# EAGLE design interface (EAGLE 5.10)
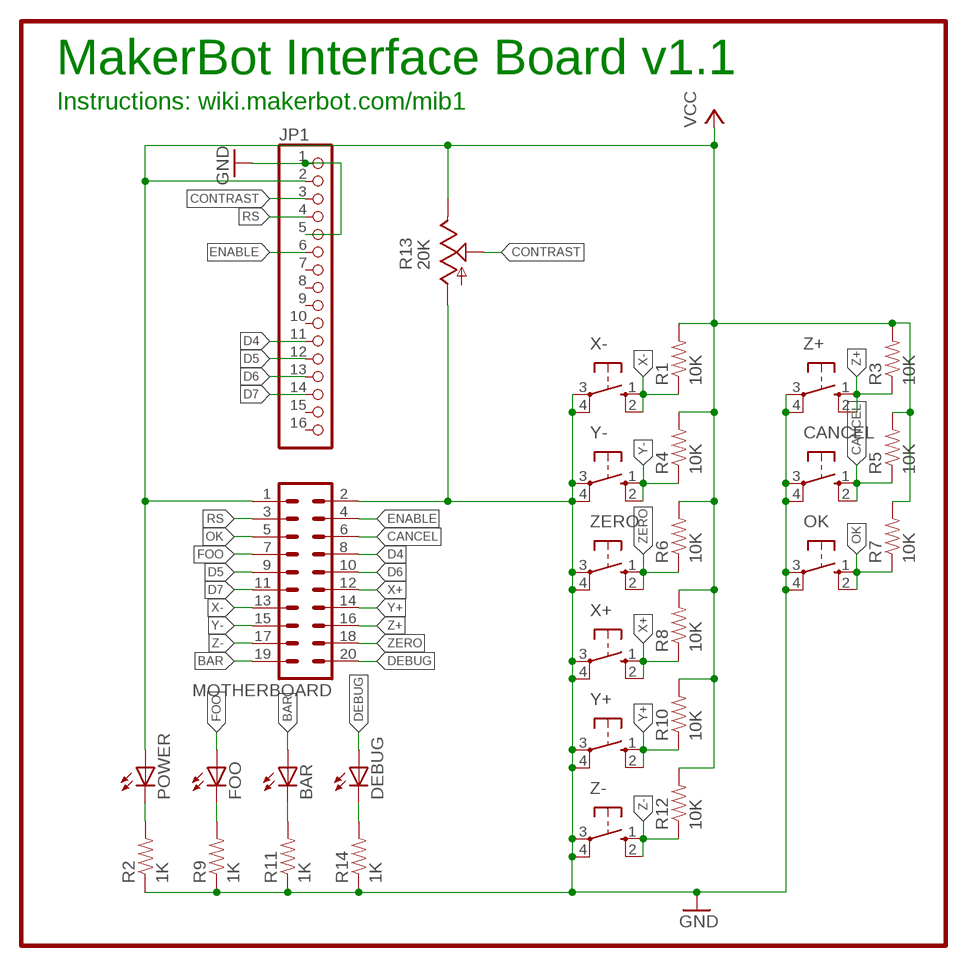
[diagram p0: schematic, sheet 1]

## Parts
BAR  LED5MM  [LED5MM]
CANCEL  40-XX  [B3F-40XX]
DEBUG  LED5MM  [LED5MM]
FOO  LED5MM  [LED5MM]
JP1  PINHD-1X16  [1X16]
MOTHERBOARD  ML20  [ML20]
OK  40-XX  [B3F-40XX]
POWER  LED5MM  [LED5MM]
R1  10K  RESISTORPTH1  [AXIAL-0.3]
R2  1K  RESISTORPTH1  [AXIAL-0.3]
R3  10K  RESISTORPTH1  [AXIAL-0.3]
R4  10K  RESISTORPTH1  [AXIAL-0.3]
R5  10K  RESISTORPTH1  [AXIAL-0.3]
R6  10K  RESISTORPTH1  [AXIAL-0.3]
R7  10K  RESISTORPTH1  [AXIAL-0.3]
R8  10K  RESISTORPTH1  [AXIAL-0.3]
R9  1K  RESISTORPTH1  [AXIAL-0.3]
R10  10K  RESISTORPTH1  [AXIAL-0.3]
R11  1K  RESISTORPTH1  [AXIAL-0.3]
R12  10K  RESISTORPTH1  [AXIAL-0.3]
R13  20K  TRIM_US-B25P  [B25P]
R14  1K  RESISTORPTH1  [AXIAL-0.3]
X+  40-XX  [B3F-40XX]
X-  40-XX  [B3F-40XX]
Y+  40-XX  [B3F-40XX]
Y-  40-XX  [B3F-40XX]
Z+  40-XX  [B3F-40XX]
Z-  40-XX  [B3F-40XX]
ZERO  40-XX  [B3F-40XX]

## Nets
BAR: BAR.A MOTHERBOARD.19
CANCEL: CANCEL.1(S) CANCEL.2(S1) MOTHERBOARD.6 R5.P$1
CONTRAST: JP1.3 R13.S
D4: JP1.11 MOTHERBOARD.8
D5: JP1.12 MOTHERBOARD.9
D6: JP1.13 MOTHERBOARD.10
D7: JP1.14 MOTHERBOARD.11
DEBUG: DEBUG.A MOTHERBOARD.20
ENABLE: JP1.6 MOTHERBOARD.4
FOO: FOO.A MOTHERBOARD.7
GND: CANCEL.3(P) CANCEL.4(P1) JP1.1 JP1.5 MOTHERBOARD.2 OK.3(P) OK.4(P1) R2.P$1 R9.P$1 R11.P$1 R13.A R14.P$1 X+.3(P) X+.4(P1) X-.3(P) X-.4(P1) Y+.3(P) Y+.4(P1) Y-.3(P) Y-.4(P1) Z+.3(P) Z+.4(P1) Z-.3(P) Z-.4(P1) ZERO.3(P) ZERO.4(P1)
N$1: POWER.K(C) R2.P$2
N$2: FOO.K(C) R9.P$2
N$3: BAR.K(C) R11.P$2
N$4: DEBUG.K(C) R14.P$2
OK: MOTHERBOARD.5 OK.1(S) OK.2(S1) R7.P$1
RS: JP1.4 MOTHERBOARD.3
VCC: JP1.2 MOTHERBOARD.1 POWER.A R1.P$2 R3.P$2 R4.P$2 R5.P$2 R6.P$2 R7.P$2 R8.P$2 R10.P$2 R12.P$2 R13.E
X+: MOTHERBOARD.12 R8.P$1 X+.1(S) X+.2(S1)
X-: MOTHERBOARD.13 R1.P$1 X-.1(S) X-.2(S1)
Y+: MOTHERBOARD.14 R10.P$1 Y+.1(S) Y+.2(S1)
Y-: MOTHERBOARD.15 R4.P$1 Y-.1(S) Y-.2(S1)
Z+: MOTHERBOARD.16 R3.P$1 Z+.1(S) Z+.2(S1)
Z-: MOTHERBOARD.17 R12.P$1 Z-.1(S) Z-.2(S1)
ZERO: MOTHERBOARD.18 R6.P$1 ZERO.1(S) ZERO.2(S1)
Unconnected: JP1.7 JP1.8 JP1.9 JP1.10 JP1.15 JP1.16

## Notes on the sheet
- MakerBot Interface Board v1.1
- Instructions: wiki.makerbot.com/mib1

## Library data of the parts
BAR DEBUG FOO POWER = led:LED: LED OSRAM: - CHIPLED LG R971, LG N971, LY N971, LG Q971, LY Q971, LO R971, LY R971 LH N974, LH R974 LS Q976, LO Q976, LY Q976 LO Q996 - Hyper CHIPLED LW Q18S LB Q993, LB Q99A, LB R99A - SideLED LS A670, LO A670, LY A670, LG A670, LP A670 LB A673, LV A673, LT A673, LW A673 LH A674 LY A675 LS A676, LA A676, LO A676, LY A676, LW A676 LS A679, LY A679, LG A679 - Hyper Micro SIDELED® LS Y876, LA Y876, LO Y876, LY Y876 LT Y87S - SmartLED LW L88C, LW L88S LB L89C, LB L89S, LG L890 LS L89K, LO L89K, LY L89K LS L896, LA L896, LO L896, LY L896 - TOPLED LS T670, LO T670, LY T670, LG T670, LP T670 LSG T670, LSP T670, LSY T670, LOP T670, LYG T670 LG T671, LOG T671, LSG T671 LB T673, LV T673, LT T673, LW T673 LH T674 LS T676, LA T676, LO T676, LY T676, LB T676, LH T676, LSB T676, LW T676 LB T67C, LV T67C, LT T67C, LS T67K, LO T67K, LY T67K, LW E67C LS E67B, LA E67B, LO E67B, LY E67B, LB E67C, LV E67C, LT E67C LW T67C LS T679, LY T679, LG T679 LS T770, LO T770, LY T770, LG T770, LP T770 LB T773, LV T773, LT T773, LW T773 LH T774 LS E675, LA E675, LY E675, LS T675 LS T776, LA T776, LO T776, LY T776, LB T776 LHGB T686 LT T68C, LB T68C - Hyper Mini TOPLED® LB M676 - Mini TOPLED Santana® LG M470 LS M47K, LO M47K, LY M47K Source: http://www.osram.convergy.de LUXEON: - LUMILED® LXK2-PW12-R00, LXK2-PW12-S00, LXK2-PW14-U00, LXK2-PW14-V00 LXK2-PM12-R00, LXK2-PM12-S00, LXK2-PM14-U00 LXK2-PE12-Q00, LXK2-PE12-R00, LXK2-PE12-S00, LXK2-PE14-T00, LXK2-PE14-U00 LXK2-PB12-K00, LXK2-PB12-L00, LXK2-PB12-M00, LXK2-PB14-N00, LXK2-PB14-P00, LXK2-PB14-Q00 LXK2-PR12-L00, LXK2-PR12-M00, LXK2-PR14-Q00, LXK2-PR14-R00 LXK2-PD12-Q00, LXK2-PD12-R00, LXK2-PD12-S00 LXK2-PH12-R00, LXK2-PH12-S00 LXK2-PL12-P00, LXK2-PL12-Q00, LXK2-PL12-R00 Source: www.luxeon.com KINGBRIGHT: KA-3528ASYC Source: www.kingbright.com
CANCEL OK X+ X- Y+ Y- Z+ Z- ZERO = switch-omron:40-XX: OMRON SWITCH
JP1 = pinhead:PINHD-1X16: PIN HEADER
MOTHERBOARD = con-ml:ML20: HARTING
R1-R12 R14 = SparkFun:RESISTOR: Resistor Basic schematic elements and footprints for 0603, 1206, and PTH 1/10th watt (small) resistors.
R13 = pot:TRIM_US-: POTENTIOMETER

## Net classes
0 default: width 0.305 mm, clearance 0.254 mm

## Board
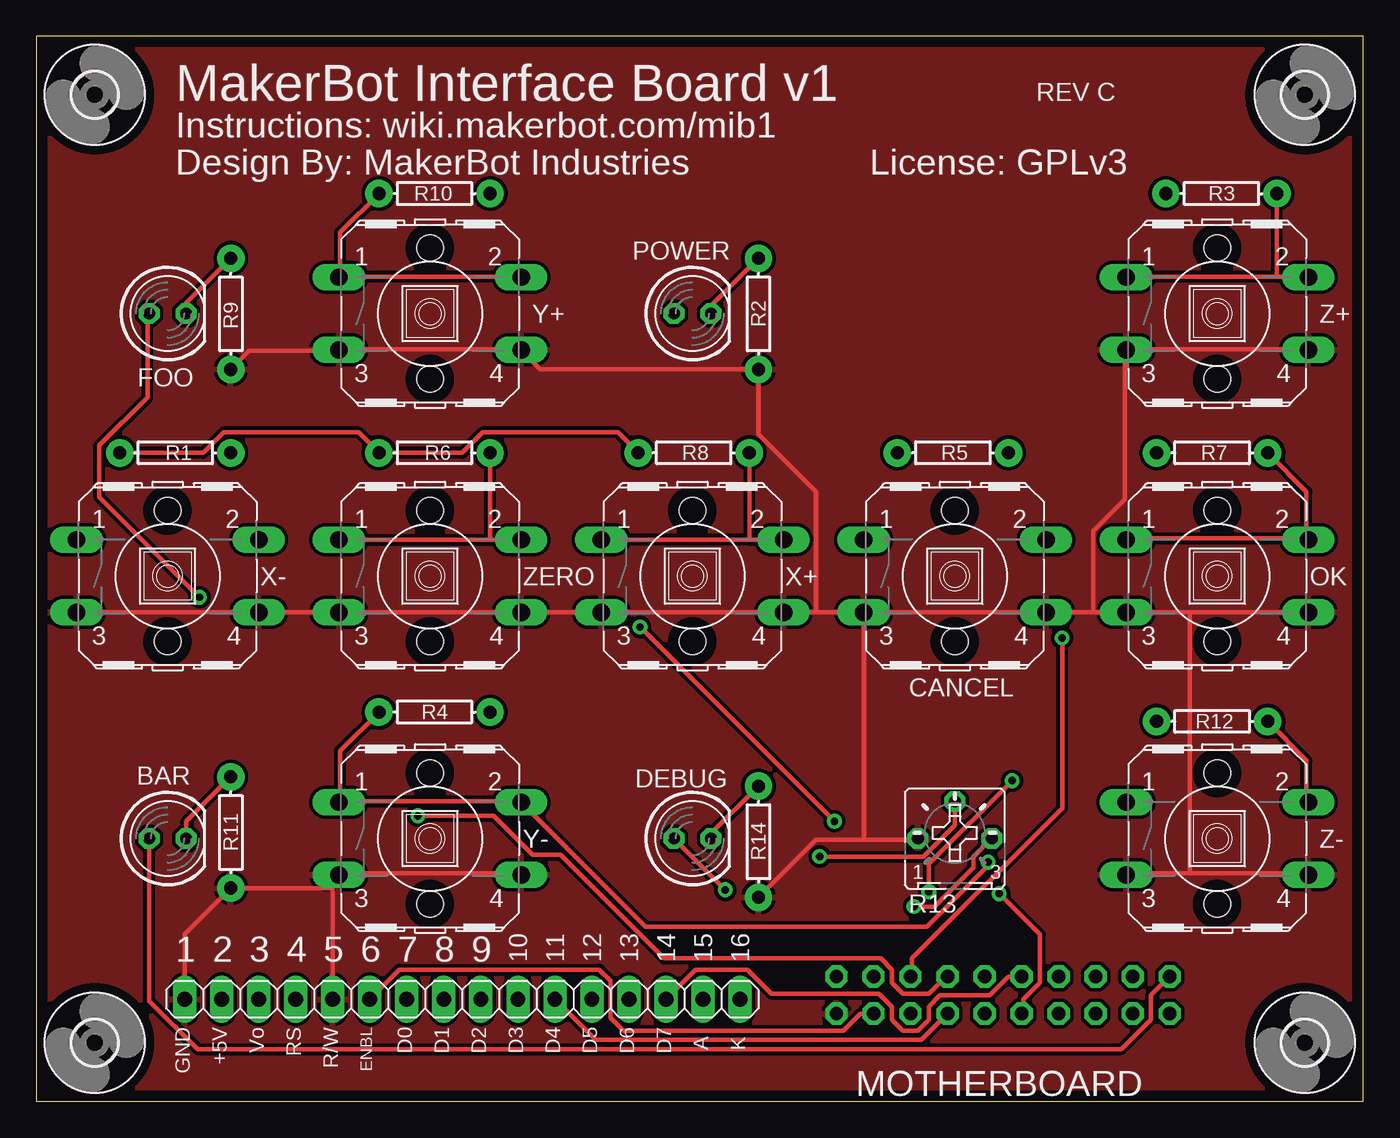
[diagram p1: board, top side]
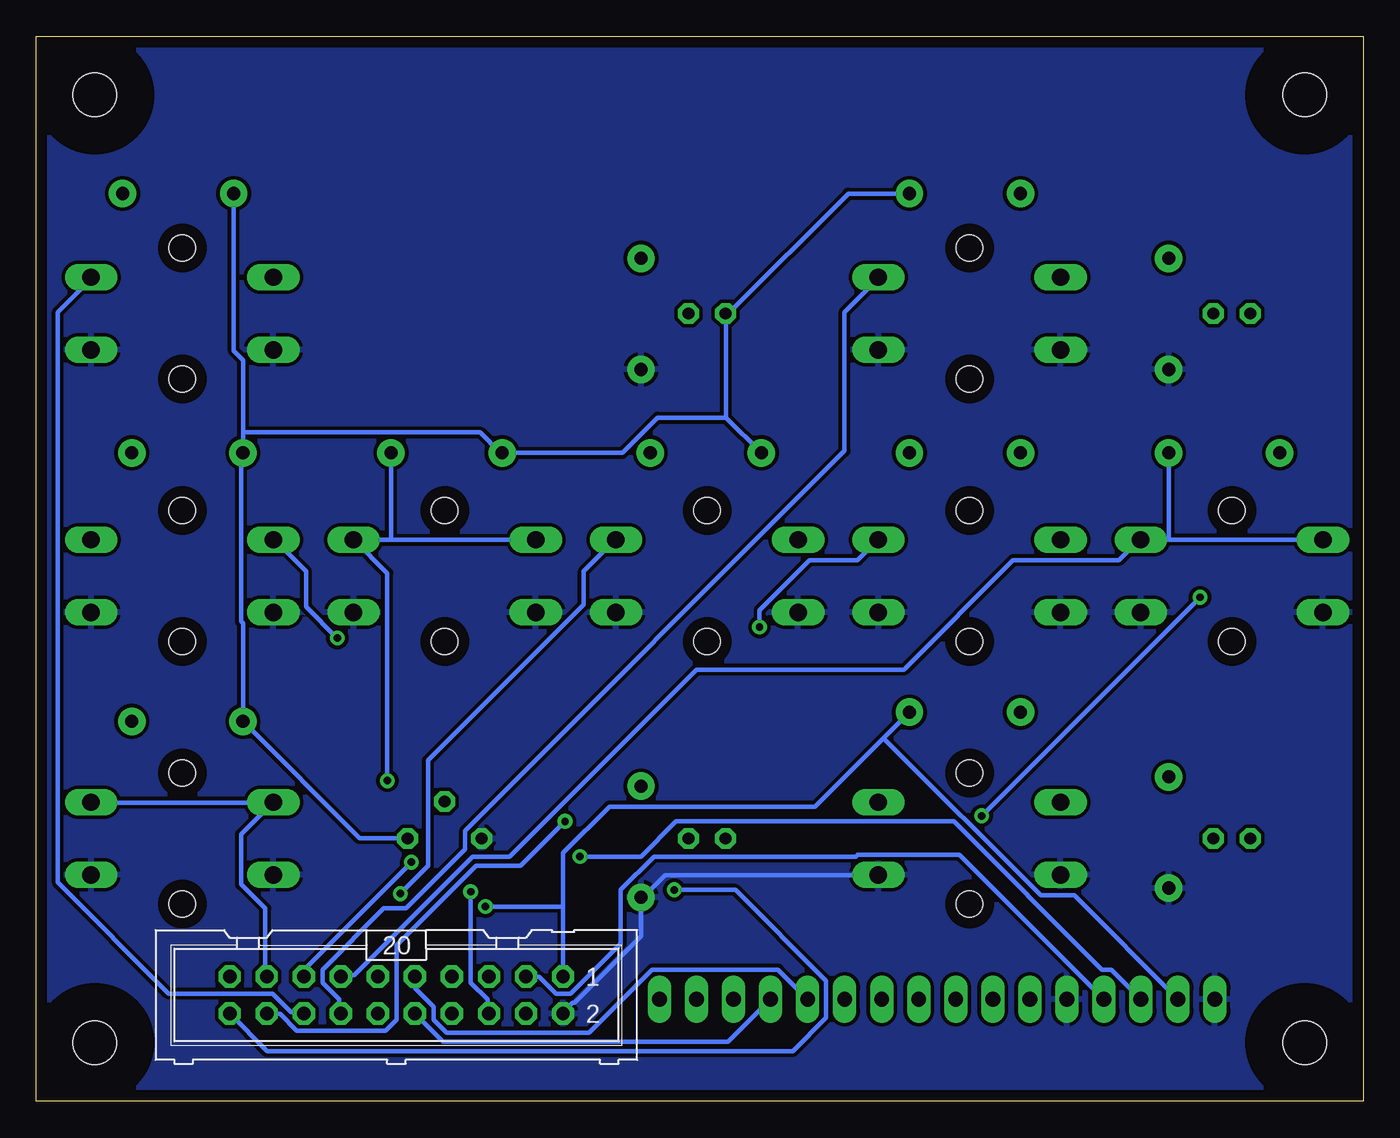
[diagram p2: board, bottom side, seen from below]

Size 91 x 73.02 mm. Coordinates in mm from the lower left corner, seen from the top.
Outline: 0,0 91,0 91,73.02 0,73.02 0,0
Copper layers (1*16): Top 0.035mm / dielectric 1.5mm / Bottom 0.035mm
Design rules "SparkFun *": minimum track width 8mil, minimum drill 20mil, track to track 8mil, track to pad 8mil, pad to pad 8mil, via to via 8mil, smd to smd 8mil, copper to edge 30mil, drill to drill 8mil, minimum pad ring 12mil, minimum via ring 10mil, stop-mask expansion 4mil, vias tented up to drill 25mil, thermal gap 10mil

### Footprints (pad centres in the part's own frame; a part is rotated, then mirrored left to right if it is on the bottom)
LED5MM = drill 0.813 octagon: A -1.27,0; K 1.27,0
B3F-40XX = drill 1.194 long: 1 -6.248,2.489; 2 6.248,2.489; 3 -6.248,-2.489; 4 6.248,-2.489 | hole 1.803: 0,-4.496; 0,4.496
1X16 = drill 1.016 long: 1 -19.05,0; 2 -16.51,0; 3 -13.97,0; 4 -11.43,0; 5 -8.89,0; 6 -6.35,0; 7 -3.81,0; 8 -1.27,0; 9 1.27,0; 10 3.81,0; 11 6.35,0; 12 8.89,0; 13 11.43,0; 14 13.97,0; 15 16.51,0; 16 19.05,0
ML20 = drill 0.914 octagon: 1 -11.43,-1.27; 2 -11.43,1.27; 3 -8.89,-1.27; 4 -8.89,1.27; 5 -6.35,-1.27; 6 -6.35,1.27; 7 -3.81,-1.27; 8 -3.81,1.27; 9 -1.27,-1.27; 10 -1.27,1.27; 11 1.27,-1.27; 12 1.27,1.27; 13 3.81,-1.27; 14 3.81,1.27; 15 6.35,-1.27; 16 6.35,1.27; 17 8.89,-1.27; 18 8.89,1.27; 19 11.43,-1.27; 20 11.43,1.27
AXIAL-0.3 = drill 0.9 pad 1.88 round: P$1 -3.81,0; P$2 3.81,0
B25P = drill 0.813 octagon: A -2.54,0; E 2.54,0; S 0,2.54
3,0 = hole 3: 0,0

### Placement (x,y rotation side)
BAR  9,18.02 0 top
CANCEL  63,36.02 0 top
DEBUG  45,18.02 0 top
FOO  9,54.02 0 top
JP1  29.21,7 0 top
MOTHERBOARD  66.31,7.28 180 bottom
OK  81,36.02 0 top
POWER  45,54.02 0 top
R1  9.53,44.47 180 top
R2  49.53,53.99 90 top
R3  81.28,62.24 180 top
R4  27.3,26.69 0 top
R5  62.87,44.47 180 top
R6  27.3,44.47 180 top
R7  80.64,44.47 180 top
R8  45.09,44.47 180 top
R9  13.34,53.99 90 top
R10  27.3,62.24 0 top
R11  13.34,18.43 90 top
R12  80.64,26.05 180 top
R13  63,18.02 0 top
R14  49.53,17.8 90 top
U$1  [3,0]  4,69.02 0 top
U$2  [3,0]  4,4.01 0 top
U$3  [3,0]  87,69.02 0 top
U$4  [3,0]  87,4.01 0 top
X+  45,36.02 0 top
X-  9,36.02 0 top
Y+  27,54.02 0 top
Y-  27,18.02 0 top
Z+  81,54.02 0 top
Z-  81,18.02 0 top
ZERO  27,36.02 0 top

### Tracks (layer width: path | path; a pad name or v marks a point on that pad's centre or on a via)
BAR
  Top 0.305: BAR.A 7.75,17.92 7.75,6.87 11.05,3.57 74.42,3.57 76.45,5.6 76.45,7.25 77.72,8.52 MOTHERBOARD.19
CANCEL  (via drill 0.51)
  Top 0.305: v61.21,14.37 61.21,16.27 v66.93,21.99
  Bottom 0.305: v61.21,14.37 61.21,8.14 60.07,7 60.07,6.11 MOTHERBOARD.6 | v66.93,21.99 66.93,36.21 69.22,38.5 CANCEL.2 69.09,38.5 66.67,38.5 | 66.67,38.5 56.77,38.5 CANCEL.1 | 66.67,38.5 R5.P$1
CONTRAST  (via drill 0.51)
  Top 0.305: v53.72,16.78 60.83,16.78 62.99,18.94 62.99,20.46 R13.S
  Bottom 0.305: v53.72,16.78 49.53,16.78 47.12,19.19 28.07,19.19 17.91,9.03 17.27,9.03 JP1.3
D4
  Top 0.305: JP1.11 38.35,4.21 60.71,4.21 62.48,5.98 MOTHERBOARD.8
D5
  Bottom 0.305: JP1.12 40.13,9.03 48.77,9.03 53.09,4.71 62.87,4.71 63.75,5.6 63.75,6.49 65.02,7.76 65.02,8.52 MOTHERBOARD.9
D6
  Bottom 0.305: JP1.13 43.56,4.08 63.12,4.08 65.02,5.98 MOTHERBOARD.10
D7
  Top 0.305: JP1.14 45.21,9.03 48.77,9.03 50.42,7.38 57.78,7.38 58.67,6.49 58.67,5.6 59.44,4.84 60.45,4.84 61.21,5.6 61.21,6.49 61.98,7.25 65.41,7.25 66.67,8.52 67.56,8.52 MOTHERBOARD.11
DEBUG  (via drill 0.51)
  Top 0.305: v47.24,14.49 43.81,17.92 DEBUG.A
  Bottom 0.305: v47.24,14.49 43.05,14.49 36.83,8.27 36.83,5.73 39.12,3.44 75.18,3.44 77.72,5.98 MOTHERBOARD.20
ENABLE
  Top 0.305: JP1.6 24.89,9.03 38.61,9.03 39.37,8.27 39.37,5.73 40.26,4.84 55.37,4.84 56.52,5.98 57.4,5.98 MOTHERBOARD.4
FOO  (via drill 0.51)
  Top 0.305: v11.18,34.56 4.32,41.42 4.32,44.97 7.62,48.27 7.62,53.99 FOO.A | v26.16,19.57 31.37,19.57 34.04,16.91 35.94,16.91 43.05,9.79 57.91,9.79 58.67,9.03 58.67,8.14 59.44,7.38 61.21,7.38 62.48,8.65 MOTHERBOARD.7
  Bottom 0.305: v26.16,19.57 v11.18,34.56
GND
  Top 0.305: Z+.4 87.12,51.58 74.8,51.58 Z+.3 74.68,51.45 74.68,41.29 72.52,39.13 72.52,33.54 | 79.12,15.64 87.12,15.64 Z-.4 | 79.12,15.64 74.8,15.64 Z-.3 | 72.52,33.54 74.68,33.54 OK.3 74.8,33.54 79.12,33.54 | 72.52,33.54 69.34,33.54 CANCEL.4 69.22,33.54 56.9,33.54 CANCEL.3 | 79.12,33.54 87.12,33.54 OK.4 | 79.12,33.54 79.12,15.64 | R9.P$1 14.61,51.45 20.7,51.45 Y+.3 20.83,51.58 33.15,51.58 Y+.4 33.27,51.45 34.54,50.18 R2.P$1 49.53,45.73 53.47,41.8 53.47,33.54 | JP1.1 10.16,11.45 R11.P$1 20.32,14.62 | 20.32,14.62 20.32,15.13 20.7,15.51 Y-.3 20.83,15.64 33.15,15.64 Y-.4 | 20.32,14.62 JP1.5 | 56.77,17.92 53.47,17.92 R14.P$1 | 56.77,17.92 60.45,17.92 R13.A | 53.47,33.54 56.64,33.54 CANCEL.3 | 53.47,33.54 51.31,33.54 X+.4 51.18,33.54 38.86,33.54 X+.3 38.73,33.54 33.27,33.54 ZERO.4 33.15,33.54 20.83,33.54 ZERO.3 20.7,33.54 15.37,33.54 X-.4 15.24,33.54 2.79,33.54 X-.3 | 56.77,17.92 56.77,33.42 CANCEL.3
  Bottom 0.305: MOTHERBOARD.2 54.86,6.11 54.23,6.75 54.1,6.75 49.53,11.32 R14.P$1 49.4,13.99 47.88,15.51 33.27,15.51 Y-.4
  pour Top: 0,73.04 90.81,73.04 90.81,0.01 0,0.01
  pour Bottom: 0,73.04 90.81,73.04 90.81,0.01 0,0.01
N$1
  Top 0.305: R2.P$2 46.35,54.62 46.35,54.12 POWER.K
N$2
  Top 0.305: R9.P$2 10.29,54.75 10.29,54.12 FOO.K
N$3
  Top 0.305: R11.P$2 10.29,19.19 10.29,18.05 BAR.K
N$4
  Top 0.305: R14.P$2 46.35,18.43 46.35,18.05 DEBUG.K
OK  (via drill 0.51)
  Top 0.305: R7.P$1 87.12,41.8 87.12,38.62 OK.2 87,38.62 74.8,38.62 OK.1 | v70.36,31.77 70.36,20.08 60.07,9.79 60.07,8.65 MOTHERBOARD.5
  Bottom 0.305: v70.36,31.77 72.52,33.92 72.52,36.34 74.68,38.5 OK.1
RS
  Bottom 0.305: JP1.4 27.69,16.91 34.67,16.91 34.8,16.78 48.64,16.78 50.93,14.49 50.93,10.81 54.36,7.38 55.37,7.38 56.52,8.52 57.4,8.52 MOTHERBOARD.3
VCC  (via drill 0.51)
  Top 0.305: R1.P$2 11.43,44.47 12.83,45.86 22.1,45.86 R6.P$2 29.21,44.47 30.61,45.86 39.88,45.86 R8.P$2 | v60.2,13.35 61.59,13.35 64.26,16.02 64.26,16.78 65.53,18.05 R13.E
  Bottom 0.305: 54.86,13.35 54.86,17.03 51.69,20.21 37.59,20.21 32.89,24.91 | 54.86,13.35 54.86,8.65 MOTHERBOARD.1 | 32.89,24.91 R4.P$2 | JP1.2 19.81,14.11 22.1,14.11 32.89,24.91 | R13.E 65.66,18.05 68.83,18.05 R12.P$2 76.83,32.78 76.96,32.91 76.96,44.47 R7.P$2 76.83,45.86 | 76.83,45.86 76.83,50.81 77.47,51.45 R3.P$2 | 43.69,46.88 43.69,53.99 POWER.A 43.56,53.99 35.31,62.24 R10.P$2 | 43.69,46.88 R8.P$2 | 43.69,46.88 48.39,46.88 50.8,44.47 R5.P$2 59.18,44.47 60.58,45.86 76.83,45.86 | 54.86,13.35 v60.2,13.35
X+  (via drill 0.51)
  Top 0.305: v66.04,14.24 68.83,11.45 68.83,8.14 67.69,7 67.69,6.11 MOTHERBOARD.12 | 48.9,38.5 51.18,38.5 X+.2 | 48.9,38.5 38.86,38.5 X+.1 | 48.9,38.5 R8.P$1
  Bottom 0.305: v66.04,14.24 64.14,16.14 64.14,23.38 53.47,34.05 53.47,36.34 51.31,38.5 X+.2
X-
  Bottom 0.305: MOTHERBOARD.13 70.1,8.65 69.22,8.65 61.09,16.78 58.55,16.78 45.72,29.61 31.5,29.61 24,37.1 16.76,37.1 15.37,38.5 X-.2 15.11,38.5 13.34,38.5 | 13.34,38.5 2.79,38.5 X-.1 | 13.34,38.5 R1.P$1
Y+
  Top 0.305: R10.P$1 20.83,59.58 20.83,56.53 Y+.1 20.95,56.53 33.15,56.53 Y+.2
  Bottom 0.305: MOTHERBOARD.14 70.23,6.11 70.23,7 71.37,8.14 71.37,9.03 67.18,13.22 65.66,13.22 61.59,17.29 61.59,18.56 35.56,44.59 35.56,54.12 33.27,56.4 Y+.2
Y-  (via drill 0.51)
  Top 0.305: R4.P$1 20.83,24.02 20.83,20.59 Y-.1 20.95,20.59 33.15,20.59 Y-.2 33.27,20.46 41.78,11.95 61.09,11.95 65.28,16.14 v65.28,16.4
  Bottom 0.305: v65.28,16.4 72.64,9.03 72.64,8.65 MOTHERBOARD.15
Z+
  Top 0.305: 85.09,56.53 87.12,56.53 Z+.2 | 85.09,56.53 74.8,56.53 Z+.1 | 85.09,56.53 R3.P$1
  Bottom 0.305: MOTHERBOARD.16 72.77,6.11 73.53,6.11 74.8,7.38 81.92,7.38 89.53,15 89.53,54.12 87.25,56.4 Z+.2
Z-
  Top 0.305: R12.P$1 87.12,23.38 87.12,20.59 Z-.2
  Bottom 0.305: MOTHERBOARD.17 75.31,8.65 75.31,13.22 76.96,14.87 76.96,18.3 74.8,20.46 Z-.1 74.93,20.46 87.12,20.46 Z-.2
ZERO  (via drill 0.51)
  Top 0.305: v41.4,32.53 v54.74,19.19 | 31.11,38.5 33.15,38.5 ZERO.2 | 31.11,38.5 20.83,38.5 ZERO.1 | 31.11,38.5 R6.P$1
  Bottom 0.305: v54.74,19.19 57.78,16.14 60.83,16.14 66.29,10.68 66.29,5.6 67.06,4.84 73.15,4.84 74.3,5.98 75.18,5.98 MOTHERBOARD.18 | v41.4,32.53 41.4,33.67 37.97,37.1 34.67,37.1 33.27,38.5 ZERO.2

### Text on the board
tPlace: MakerBot Interface Board v1 | REV C | Instructions: wiki.makerbot.com/mib1 | Design By: MakerBot Industries | License: GPLv3 | 1 | 2 | 3 | 4 | 5 | 6 | 7 | 8 | 9 | 10 | 11 | 12 | 13 | 14 | 15 | 16 | GND | +5V | Vo | RS | R/W | ENBL | D0 | D1 | D2 | D3 | D4 | D5 | D6 | D7 | A | K